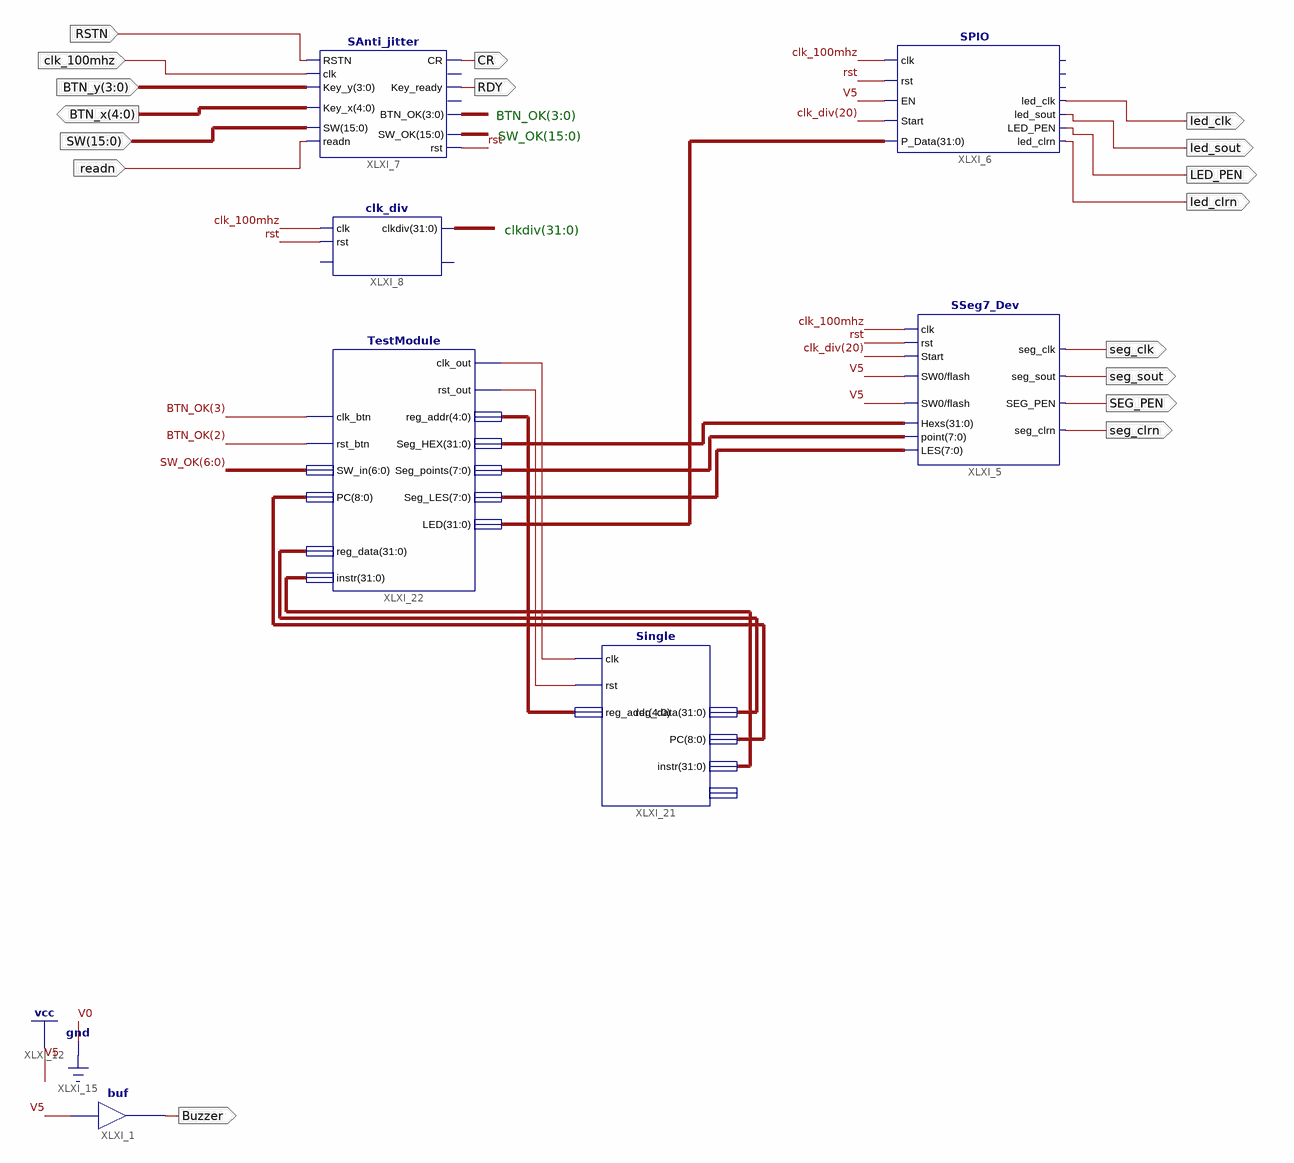
[diagram p0: schematic sheet 1]
// Xilinx ISE schematic top_sch.sch (kintex7) as structural Verilog: 7 symbols, 17 ports
module top_sch (
  input  RSTN,
  input  [3:0] BTN_y,
  input  [15:0] SW,
  input  readn,
  input  clk_100mhz,
  output Buzzer,
  output [4:0] BTN_x,
  output CR,
  output seg_sout,
  output SEG_PEN,
  output seg_clrn,
  output seg_clk,
  output RDY,
  output led_sout,
  output LED_PEN,
  output led_clrn,
  output led_clk
);

  wire rst, XLXN_30, XLXN_31;
  wire [3:0] BTN_OK;
  wire [4:0] XLXN_32;
  wire [7:0] XLXN_22, XLXN_23;
  wire [8:0] XLXN_39;
  wire [15:0] SW_OK;
  wire [31:0] clk_div, XLXN_21, XLXN_24, XLXN_40, XLXN_41;

  buf XLXI_1 (Buzzer, 1'b1);
  SAnti_jitter XLXI_7 (
    .SW(SW), .readn(readn), .Key_y(BTN_y), .Key_x(BTN_x), .RSTN(RSTN), .clk(clk_100mhz), .Key_ready(RDY),
    .CR(CR), .rst(rst), .SW_OK(SW_OK), .BTN_OK(BTN_OK));  // open: Key_out, pulse_out
  clk_div XLXI_8 (.rst(rst), .clk(clk_100mhz), .clkdiv(clk_div));  // open: SW2, Clk_CPU
  SSeg7_Dev XLXI_5 (
    .LES(XLXN_23), .SEG_PEN(SEG_PEN), .seg_sout(seg_sout), .seg_clrn(seg_clrn), .point(XLXN_22),
    .Hexs(XLXN_21), .SW0(1'b1), .flash(1'b1), .seg_clk(seg_clk), .clk(clk_100mhz), .rst(rst),
    .Start(clk_div[20]));
  SPIO XLXI_6 (
    .clk(clk_100mhz), .P_Data(XLXN_24), .rst(rst), .EN(1'b1), .Start(clk_div[20]), .led_clk(led_clk),
    .led_clrn(led_clrn), .LED_PEN(LED_PEN), .led_sout(led_sout));  // open: GPIOf0, LED_out, counter_set
  Single XLXI_21 (
    .clk(XLXN_30), .rst(XLXN_31), .reg_addr(XLXN_32), .reg_data(XLXN_40), .PC(XLXN_39), .instr(XLXN_41));  // open: sim
  TestModule XLXI_22 (
    .clk_btn(BTN_OK[3]), .rst_btn(BTN_OK[2]), .SW_in(SW_OK[6:0]), .PC(XLXN_39), .instr(XLXN_41),
    .reg_data(XLXN_40), .clk_out(XLXN_30), .rst_out(XLXN_31), .reg_addr(XLXN_32), .Seg_HEX(XLXN_21),
    .Seg_points(XLXN_22), .Seg_LES(XLXN_23), .LED(XLXN_24));

  // Notes on the sheet:
  //   BTN_OK(3:0)
  //   SW_OK(15:0)
  //   clkdiv(31:0)
endmodule
